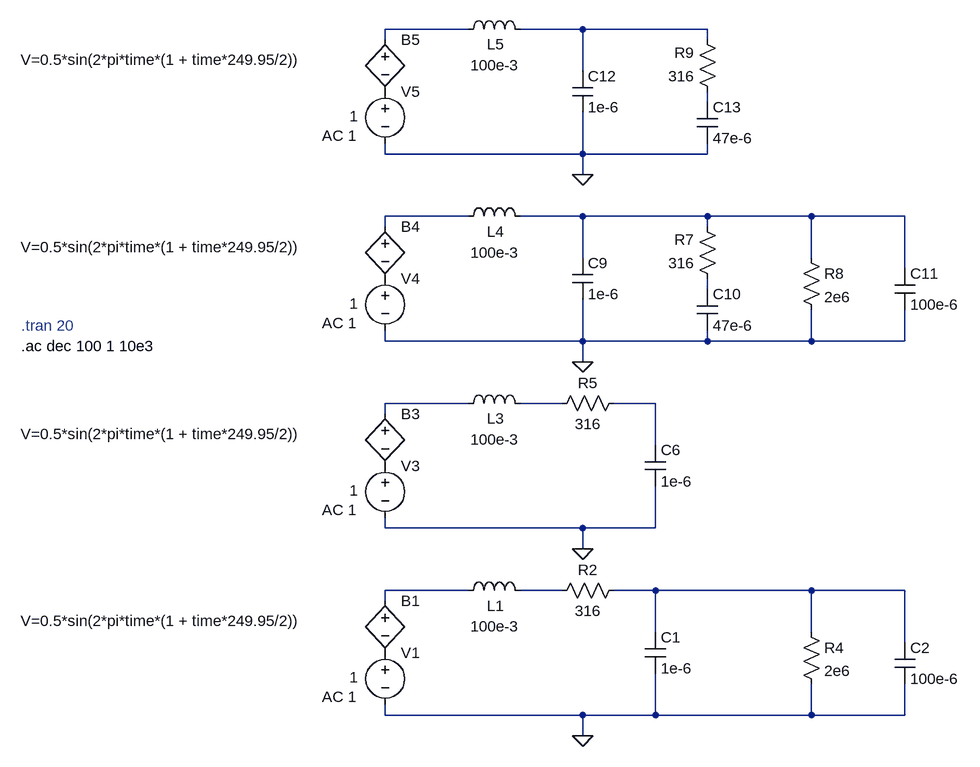
[diagram p0: schematic InputFilter.asc]
InputFilter.asc, the LTspice schematic file:
Version 4.1
SHEET 1 2396 680
WIRE -160 -832 -288 -832
WIRE 16 -832 -80 -832
WIRE 208 -832 16 -832
WIRE -288 -816 -288 -832
WIRE 208 -816 208 -832
WIRE 16 -768 16 -832
WIRE 208 -720 208 -736
WIRE -288 -640 -288 -656
WIRE 16 -640 16 -704
WIRE 16 -640 -288 -640
WIRE 208 -640 208 -656
WIRE 208 -640 16 -640
WIRE 16 -608 16 -640
WIRE -160 -544 -288 -544
WIRE 16 -544 -80 -544
WIRE 208 -544 16 -544
WIRE 368 -544 208 -544
WIRE 512 -544 368 -544
WIRE -288 -528 -288 -544
WIRE 208 -528 208 -544
WIRE 16 -480 16 -544
WIRE 368 -480 368 -544
WIRE 512 -464 512 -544
WIRE 208 -432 208 -448
WIRE -288 -352 -288 -368
WIRE 16 -352 16 -416
WIRE 16 -352 -288 -352
WIRE 208 -352 208 -368
WIRE 208 -352 16 -352
WIRE 368 -352 368 -400
WIRE 368 -352 208 -352
WIRE 512 -352 512 -400
WIRE 512 -352 368 -352
WIRE 16 -320 16 -352
WIRE -160 -256 -288 -256
WIRE -16 -256 -80 -256
WIRE 128 -256 64 -256
WIRE -288 -240 -288 -256
WIRE 128 -192 128 -256
WIRE -288 -64 -288 -80
WIRE 16 -64 -288 -64
WIRE 128 -64 128 -128
WIRE 128 -64 16 -64
WIRE 16 -32 16 -64
WIRE -160 32 -288 32
WIRE -16 32 -80 32
WIRE 128 32 64 32
WIRE 368 32 128 32
WIRE 512 32 368 32
WIRE -288 48 -288 32
WIRE 128 96 128 32
WIRE 368 96 368 32
WIRE 512 112 512 32
WIRE -288 224 -288 208
WIRE 16 224 -288 224
WIRE 128 224 128 160
WIRE 128 224 16 224
WIRE 368 224 368 176
WIRE 368 224 128 224
WIRE 512 224 512 176
WIRE 512 224 368 224
WIRE 16 256 16 224
FLAG 16 -32 0
FLAG 16 -320 0
FLAG 16 -608 0
FLAG 16 256 0
SYMBOL ind -176 -240 R270
WINDOW 0 -23 58 VTop 2
WINDOW 3 -24 57 VBottom 2
SYMATTR InstName L3
SYMATTR Value 100e-3
SYMATTR SpiceLine Rser=120
SYMBOL cap 112 -192 R0
SYMATTR InstName C6
SYMATTR Value 1e-6
SYMBOL res -32 -240 R270
WINDOW 0 32 56 VTop 2
WINDOW 3 0 56 VBottom 2
SYMATTR InstName R5
SYMATTR Value 316
SYMBOL bv -288 -256 R0
WINDOW 3 -561 47 Left 2
SYMATTR Value V=0.5*sin(2*pi*time*(1 + time*249.95/2))
SYMATTR InstName B3
SYMBOL voltage -288 -176 R0
WINDOW 3 -55 54 Left 2
WINDOW 123 -97 84 Left 2
WINDOW 39 0 0 Left 0
SYMATTR Value 1
SYMATTR Value2 AC 1
SYMATTR InstName V3
SYMBOL ind -176 -528 R270
WINDOW 0 -23 58 VTop 2
WINDOW 3 -24 57 VBottom 2
SYMATTR InstName L4
SYMATTR Value 100e-3
SYMATTR SpiceLine Rser=120
SYMBOL cap 0 -480 R0
SYMATTR InstName C9
SYMATTR Value 1e-6
SYMBOL res 224 -432 R180
WINDOW 0 36 76 Left 2
WINDOW 3 36 40 Left 2
SYMATTR InstName R7
SYMATTR Value 316
SYMBOL cap 192 -432 R0
SYMATTR InstName C10
SYMATTR Value 47e-6
SYMBOL bv -288 -544 R0
WINDOW 3 -561 47 Left 2
SYMATTR Value V=0.5*sin(2*pi*time*(1 + time*249.95/2))
SYMATTR InstName B4
SYMBOL voltage -288 -464 R0
WINDOW 3 -55 54 Left 2
WINDOW 123 -97 84 Left 2
WINDOW 39 0 0 Left 0
SYMATTR Value 1
SYMATTR Value2 AC 1
SYMATTR InstName V4
SYMBOL res 352 -496 R0
SYMATTR InstName R8
SYMATTR Value 2e6
SYMBOL cap 496 -464 R0
SYMATTR InstName C11
SYMATTR Value 100e-6
SYMBOL ind -176 -816 R270
WINDOW 0 -23 58 VTop 2
WINDOW 3 -24 57 VBottom 2
SYMATTR InstName L5
SYMATTR Value 100e-3
SYMATTR SpiceLine Rser=120
SYMBOL cap 0 -768 R0
SYMATTR InstName C12
SYMATTR Value 1e-6
SYMBOL res 224 -720 R180
WINDOW 0 36 76 Left 2
WINDOW 3 36 40 Left 2
SYMATTR InstName R9
SYMATTR Value 316
SYMBOL cap 192 -720 R0
SYMATTR InstName C13
SYMATTR Value 47e-6
SYMBOL bv -288 -832 R0
WINDOW 3 -561 47 Left 2
SYMATTR Value V=0.5*sin(2*pi*time*(1 + time*249.95/2))
SYMATTR InstName B5
SYMBOL voltage -288 -752 R0
WINDOW 3 -55 54 Left 2
WINDOW 123 -97 84 Left 2
WINDOW 39 0 0 Left 0
SYMATTR Value 1
SYMATTR Value2 AC 1
SYMATTR InstName V5
SYMBOL ind -176 48 R270
WINDOW 0 -23 58 VTop 2
WINDOW 3 -24 57 VBottom 2
SYMATTR InstName L1
SYMATTR Value 100e-3
SYMATTR SpiceLine Rser=120
SYMBOL cap 112 96 R0
SYMATTR InstName C1
SYMATTR Value 1e-6
SYMBOL res -32 48 R270
WINDOW 0 32 56 VTop 2
WINDOW 3 0 56 VBottom 2
SYMATTR InstName R2
SYMATTR Value 316
SYMBOL bv -288 32 R0
WINDOW 3 -561 47 Left 2
SYMATTR Value V=0.5*sin(2*pi*time*(1 + time*249.95/2))
SYMATTR InstName B1
SYMBOL voltage -288 112 R0
WINDOW 3 -55 54 Left 2
WINDOW 123 -97 84 Left 2
WINDOW 39 0 0 Left 0
SYMATTR Value 1
SYMATTR Value2 AC 1
SYMATTR InstName V1
SYMBOL res 352 80 R0
SYMATTR InstName R4
SYMATTR Value 2e6
SYMBOL cap 496 112 R0
SYMATTR InstName C2
SYMATTR Value 100e-6
TEXT -848 -344 Left 2 !.ac dec 100 1 10e3
TEXT -848 -376 Left 2 ;.tran 20

The netlist it stands for:
* InputFilter.asc
L3 N007 N008 100e-3 Rser=120
C6 N009 0 1e-6
R5 N008 N009 316
B3 N007 P001 V=0.5*sin(2*pi*time*(1 + time*249.95/2))
V3 P001 0 1 AC 1
L4 N004 N005 100e-3 Rser=120
C9 N005 0 1e-6
R7 N006 N005 316
C10 N006 0 47e-6
B4 N004 P002 V=0.5*sin(2*pi*time*(1 + time*249.95/2))
V4 P002 0 1 AC 1
R8 N005 0 2e6
C11 N005 0 100e-6
L5 N001 N002 100e-3 Rser=120
C12 N002 0 1e-6
R9 N003 N002 316
C13 N003 0 47e-6
B5 N001 P003 V=0.5*sin(2*pi*time*(1 + time*249.95/2))
V5 P003 0 1 AC 1
L1 N010 N011 100e-3 Rser=120
C1 N012 0 1e-6
R2 N011 N012 316
B1 N010 P004 V=0.5*sin(2*pi*time*(1 + time*249.95/2))
V1 P004 0 1 AC 1
R4 N012 0 2e6
C2 N012 0 100e-6
.ac dec 100 1 10e3
* .tran 20
.backanno
.end